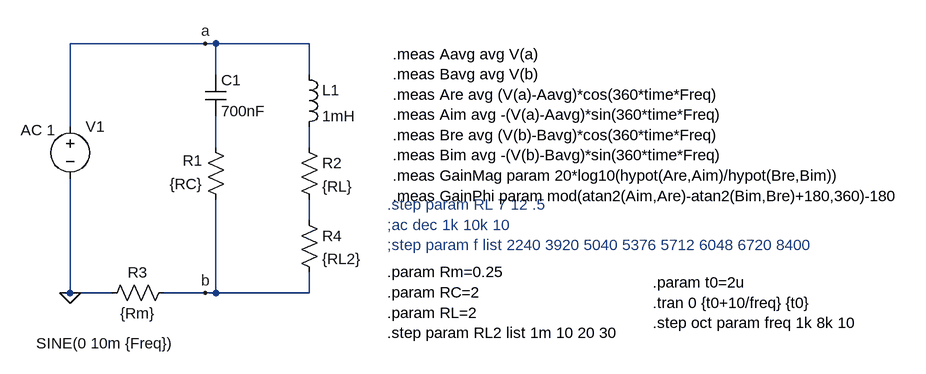
[diagram p0: schematic ortskurve_parallelschwingkreis.asc]
ortskurve_parallelschwingkreis.asc, the LTspice schematic file:
Version 4
SHEET 1 2748 1044
WIRE 240 -80 32 -80
WIRE 256 -80 240 -80
WIRE 400 -80 256 -80
WIRE 256 -32 256 -80
WIRE 400 -32 400 -80
WIRE 32 48 32 -80
WIRE 256 80 256 32
WIRE 400 80 400 48
WIRE 400 192 400 160
WIRE 32 304 32 128
WIRE 32 304 16 304
WIRE 96 304 32 304
WIRE 240 304 176 304
WIRE 256 304 256 160
WIRE 256 304 240 304
WIRE 400 304 400 272
WIRE 400 304 256 304
FLAG 32 304 0
FLAG 240 -80 a
FLAG 240 304 b
SYMBOL res 272 176 R180
WINDOW 0 36 76 Left 2
WINDOW 3 36 40 Left 2
SYMATTR InstName R1
SYMATTR Value {RC}
SYMBOL cap 240 -32 R0
SYMATTR InstName C1
SYMATTR Value 700nF
SYMBOL voltage 32 32 R0
WINDOW 3 -52 350 Left 2
WINDOW 123 -76 21 Left 2
WINDOW 39 -168 151 Left 2
SYMATTR Value SINE(0 10m {Freq})
SYMATTR Value2 AC 1
SYMATTR InstName V1
SYMBOL ind 384 -48 R0
SYMATTR InstName L1
SYMATTR Value 1mH
SYMBOL res 384 64 R0
SYMATTR InstName R2
SYMATTR Value {RL}
SYMBOL res 192 288 R90
WINDOW 0 0 56 VBottom 2
WINDOW 3 32 56 VTop 2
SYMATTR InstName R3
SYMATTR Value {Rm}
SYMBOL res 384 176 R0
SYMATTR InstName R4
SYMATTR Value {RL2}
TEXT 928 288 Left 2 !.param t0=2u\n.tran 0 {t0+10/freq} {t0}\n.step oct param freq 1k 8k 10
TEXT 520 272 Left 2 !.param Rm=0.25\n.param RC=2\n.param RL=2\n.step param RL2 list 1m 10 20 30
TEXT 520 168 Left 2 ;.step param RL 7 12 .5\n;ac dec 1k 10k 10\n;step param f list 2240 3920 5040 5376 5712 6048 6720 8400
TEXT 528 -64 Left 2 !.meas Aavg avg V(a)\n.meas Bavg avg V(b)\n.meas Are avg (V(a)-Aavg)*cos(360*time*Freq)\n.meas Aim avg -(V(a)-Aavg)*sin(360*time*Freq)\n.meas Bre avg (V(b)-Bavg)*cos(360*time*Freq)\n.meas Bim avg -(V(b)-Bavg)*sin(360*time*Freq)\n.meas GainMag param 20*log10(hypot(Are,Aim)/hypot(Bre,Bim))\n.meas GainPhi param mod(atan2(Aim,Are)-atan2(Bim,Bre)+180,360)-180

The netlist it stands for:
* ortskurve_parallelschwingkreis.asc
R1 b N001 {RC}
C1 a N001 700nF
V1 a 0 SINE(0 10m {Freq}) AC 1
L1 a N002 1mH
R2 N002 N003 {RL}
R3 b 0 {Rm}
R4 N003 b {RL2}
.param t0=2u
.tran 0 {t0+10/freq} {t0}
.step oct param freq 1k 8k 10
.param Rm=0.25
.param RC=2
.param RL=2
.step param RL2 list 1m 10 20 30
* .step param RL 7 12 .5
* ;ac dec 1k 10k 10
* ;step param f list 2240 3920 5040 5376 5712 6048 6720 8400
.meas Aavg avg V(a)
.meas Bavg avg V(b)
.meas Are avg (V(a)-Aavg)*cos(360*time*Freq)
.meas Aim avg -(V(a)-Aavg)*sin(360*time*Freq)
.meas Bre avg (V(b)-Bavg)*cos(360*time*Freq)
.meas Bim avg -(V(b)-Bavg)*sin(360*time*Freq)
.meas GainMag param 20*log10(hypot(Are,Aim)/hypot(Bre,Bim))
.meas GainPhi param mod(atan2(Aim,Are)-atan2(Bim,Bre)+180,360)-180
.backanno
.end